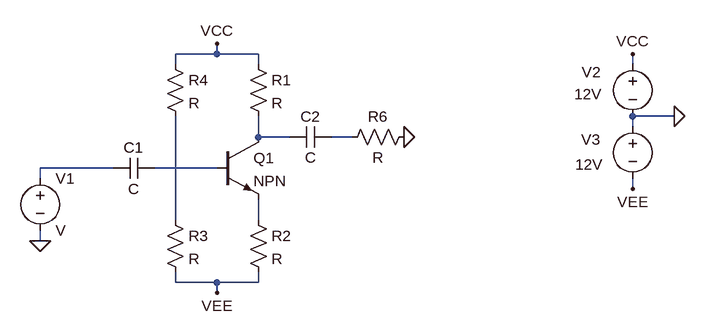
[diagram p0: schematic Draft2.asc]
Draft2.asc, the LTspice schematic file:
Version 4.1
SHEET 1 916 680
WIRE 192 -16 192 -32
WIRE 192 -16 128 -16
WIRE 256 -16 192 -16
WIRE 128 0 128 -16
WIRE 256 0 256 -16
WIRE 832 0 832 -16
WIRE 896 80 832 80
WIRE 832 96 832 80
WIRE 256 112 256 80
WIRE 304 112 256 112
WIRE 400 112 368 112
WIRE 32 160 -80 160
WIRE 192 160 96 160
WIRE -80 176 -80 160
WIRE 832 192 832 176
WIRE 128 240 128 80
WIRE 256 240 256 208
WIRE -80 272 -80 256
WIRE 128 336 128 320
WIRE 192 336 128 336
WIRE 256 336 256 320
WIRE 256 336 192 336
WIRE 192 352 192 336
FLAG -80 272 0
FLAG 480 112 0
FLAG 192 -32 VCC
FLAG 192 352 VEE
FLAG 896 80 0
FLAG 832 -16 VCC
FLAG 832 192 VEE
SYMBOL npn 192 112 R0
SYMATTR InstName Q1
SYMBOL res 240 -16 R0
SYMATTR InstName R1
SYMBOL res 240 224 R0
SYMATTR InstName R2
SYMBOL res 112 224 R0
SYMATTR InstName R3
SYMBOL res 112 -16 R0
SYMATTR InstName R4
SYMBOL cap 96 144 R90
WINDOW 0 0 32 VBottom 2
WINDOW 3 32 32 VTop 2
SYMATTR InstName C1
SYMBOL voltage -80 160 R0
SYMATTR InstName V1
SYMBOL cap 368 96 R90
WINDOW 0 0 32 VBottom 2
WINDOW 3 32 32 VTop 2
SYMATTR InstName C2
SYMBOL res 496 96 R90
WINDOW 0 0 56 VBottom 2
WINDOW 3 32 56 VTop 2
SYMATTR InstName R6
SYMBOL voltage 832 -16 R0
WINDOW 0 -78 28 Left 2
WINDOW 3 -90 62 Left 2
WINDOW 123 0 0 Left 0
WINDOW 39 0 0 Left 0
SYMATTR InstName V2
SYMATTR Value 12V
SYMBOL voltage 832 80 R0
WINDOW 0 -79 36 Left 2
WINDOW 3 -88 74 Left 2
SYMATTR InstName V3
SYMATTR Value 12V

The netlist it stands for:
* Draft2.asc
Q1 N001 N004 N006 0 NPN
R1 VCC N001 R
R2 N006 VEE R
R3 N005 VEE R
R4 VCC N005 R
C1 N004 N003 C
V1 N003 0 V
C2 N002 N001 C
R6 0 N002 R
V2 VCC 0 12V
V3 0 VEE 12V
.model NPN NPN
.model PNP PNP
.lib standard.bjt
.backanno
.end